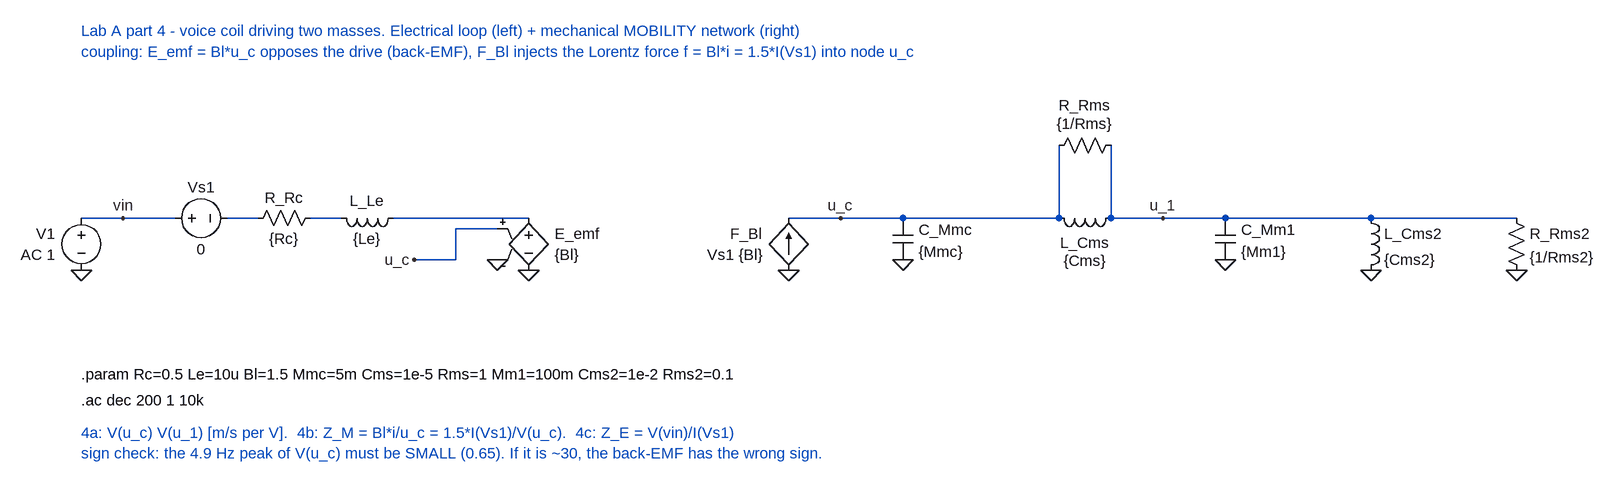
[diagram p0: schematic Part4_Coil_Electromechanical.asc]
Part4_Coil_Electromechanical.asc, the LTspice schematic file:
Version 4
SHEET 1 3000 1600
WIRE 0 0 144 0
WIRE 224 0 272 0
WIRE 352 0 400 0
WIRE 480 0 688 0
WIRE 640 16 576 16
WIRE 576 16 576 64
WIRE 576 64 512 64
WIRE 1088 0 1504 0
WIRE 1504 0 1504 -112
WIRE 1584 0 1584 -112
WIRE 1584 0 2208 0
FLAG 0 80 0
FLAG 64 0 vin
FLAG 688 80 0
FLAG 640 64 0
FLAG 512 64 u_c
FLAG 1088 80 0
FLAG 1168 0 u_c
FLAG 1264 64 0
FLAG 1664 0 u_1
FLAG 1760 64 0
FLAG 1984 80 0
FLAG 2208 80 0
SYMBOL voltage 0 -16 R0
WINDOW 0 -40 40 Right 2
WINDOW 3 -40 72 Right 2
SYMATTR InstName V1
SYMATTR Value AC 1
SYMBOL voltage 128 0 R270
WINDOW 0 32 56 VTop 2
WINDOW 3 -32 56 VBottom 2
SYMATTR InstName Vs1
SYMATTR Value 0
SYMBOL res 368 -16 R90
WINDOW 0 0 56 VBottom 2
WINDOW 3 32 56 VTop 2
SYMATTR InstName R_Rc
SYMATTR Value {Rc}
SYMBOL ind 496 -16 R90
WINDOW 0 5 56 VBottom 2
WINDOW 3 32 56 VTop 2
SYMATTR InstName L_Le
SYMATTR Value {Le}
SYMATTR SpiceLine Rser=0
SYMBOL e 688 -16 R0
WINDOW 0 40 40 Left 2
WINDOW 3 40 72 Left 2
SYMATTR InstName E_emf
SYMATTR Value {Bl}
SYMBOL f 1088 80 R180
WINDOW 0 40 56 Left 2
WINDOW 3 40 24 Left 2
SYMATTR InstName F_Bl
SYMATTR Value Vs1 {Bl}
SYMBOL cap 1248 0 R0
WINDOW 0 40 18 Left 2
WINDOW 3 40 52 Left 2
SYMATTR InstName C_Mmc
SYMATTR Value {Mmc}
SYMBOL ind 1600 -16 R90
WINDOW 0 38 56 VTop 2
WINDOW 3 66 56 VTop 2
SYMATTR InstName L_Cms
SYMATTR Value {Cms}
SYMATTR SpiceLine Rser=1u
SYMBOL res 1600 -128 R90
WINDOW 0 -30 56 VBottom 2
WINDOW 3 -2 56 VBottom 2
SYMATTR InstName R_Rms
SYMATTR Value {1/Rms}
SYMBOL cap 1744 0 R0
WINDOW 0 40 18 Left 2
WINDOW 3 40 52 Left 2
SYMATTR InstName C_Mm1
SYMATTR Value {Mm1}
SYMBOL ind 1968 -16 R0
SYMATTR InstName L_Cms2
SYMATTR Value {Cms2}
SYMATTR SpiceLine Rser=0
SYMBOL res 2192 -16 R0
SYMATTR InstName R_Rms2
SYMATTR Value {1/Rms2}
TEXT 0 -288 Left 2 ;Lab A part 4 - voice coil driving two masses. Electrical loop (left) + mechanical MOBILITY network (right)
TEXT 0 -256 Left 2 ;coupling: E_emf = Bl*u_c opposes the drive (back-EMF), F_Bl injects the Lorentz force f = Bl*i = 1.5*I(Vs1) into node u_c
TEXT 0 240 Left 2 !.param Rc=0.5 Le=10u Bl=1.5 Mmc=5m Cms=1e-5 Rms=1 Mm1=100m Cms2=1e-2 Rms2=0.1
TEXT 0 280 Left 2 !.ac dec 200 1 10k
TEXT 0 330 Left 2 ;4a: V(u_c) V(u_1) [m/s per V].  4b: Z_M = Bl*i/u_c = 1.5*I(Vs1)/V(u_c).  4c: Z_E = V(vin)/I(Vs1)
TEXT 0 362 Left 2 ;sign check: the 4.9 Hz peak of V(u_c) must be SMALL (0.65). If it is ~30, the back-EMF has the wrong sign.

The netlist it stands for:
* Part4_Coil_Electromechanical.asc
V1 vin 0 AC 1
Vs1 vin N001 0
R_Rc N002 N001 {Rc}
L_Le N003 N002 {Le} Rser=0
E_emf N003 0 u_c 0 {Bl}
F_Bl 0 u_c Vs1 {Bl}
C_Mmc u_c 0 {Mmc}
L_Cms u_1 u_c {Cms} Rser=1u
R_Rms u_1 u_c {1/Rms}
C_Mm1 u_1 0 {Mm1}
L_Cms2 u_1 0 {Cms2} Rser=0
R_Rms2 u_1 0 {1/Rms2}
* Lab A part 4 - voice coil driving two masses. Electrical loop (left) + mechanical MOBILITY network (right)
* coupling: E_emf = Bl*u_c opposes the drive (back-EMF), F_Bl injects the Lorentz force f = Bl*i = 1.5*I(Vs1) into node u_c
.param Rc=0.5 Le=10u Bl=1.5 Mmc=5m Cms=1e-5 Rms=1 Mm1=100m Cms2=1e-2 Rms2=0.1
.ac dec 200 1 10k
* 4a: V(u_c) V(u_1) [m/s per V].  4b: Z_M = Bl*i/u_c = 1.5*I(Vs1)/V(u_c).  4c: Z_E = V(vin)/I(Vs1)
* sign check: the 4.9 Hz peak of V(u_c) must be SMALL (0.65). If it is ~30, the back-EMF has the wrong sign.
.backanno
.end